# Altium project ludi_console_v1.PrjPcb
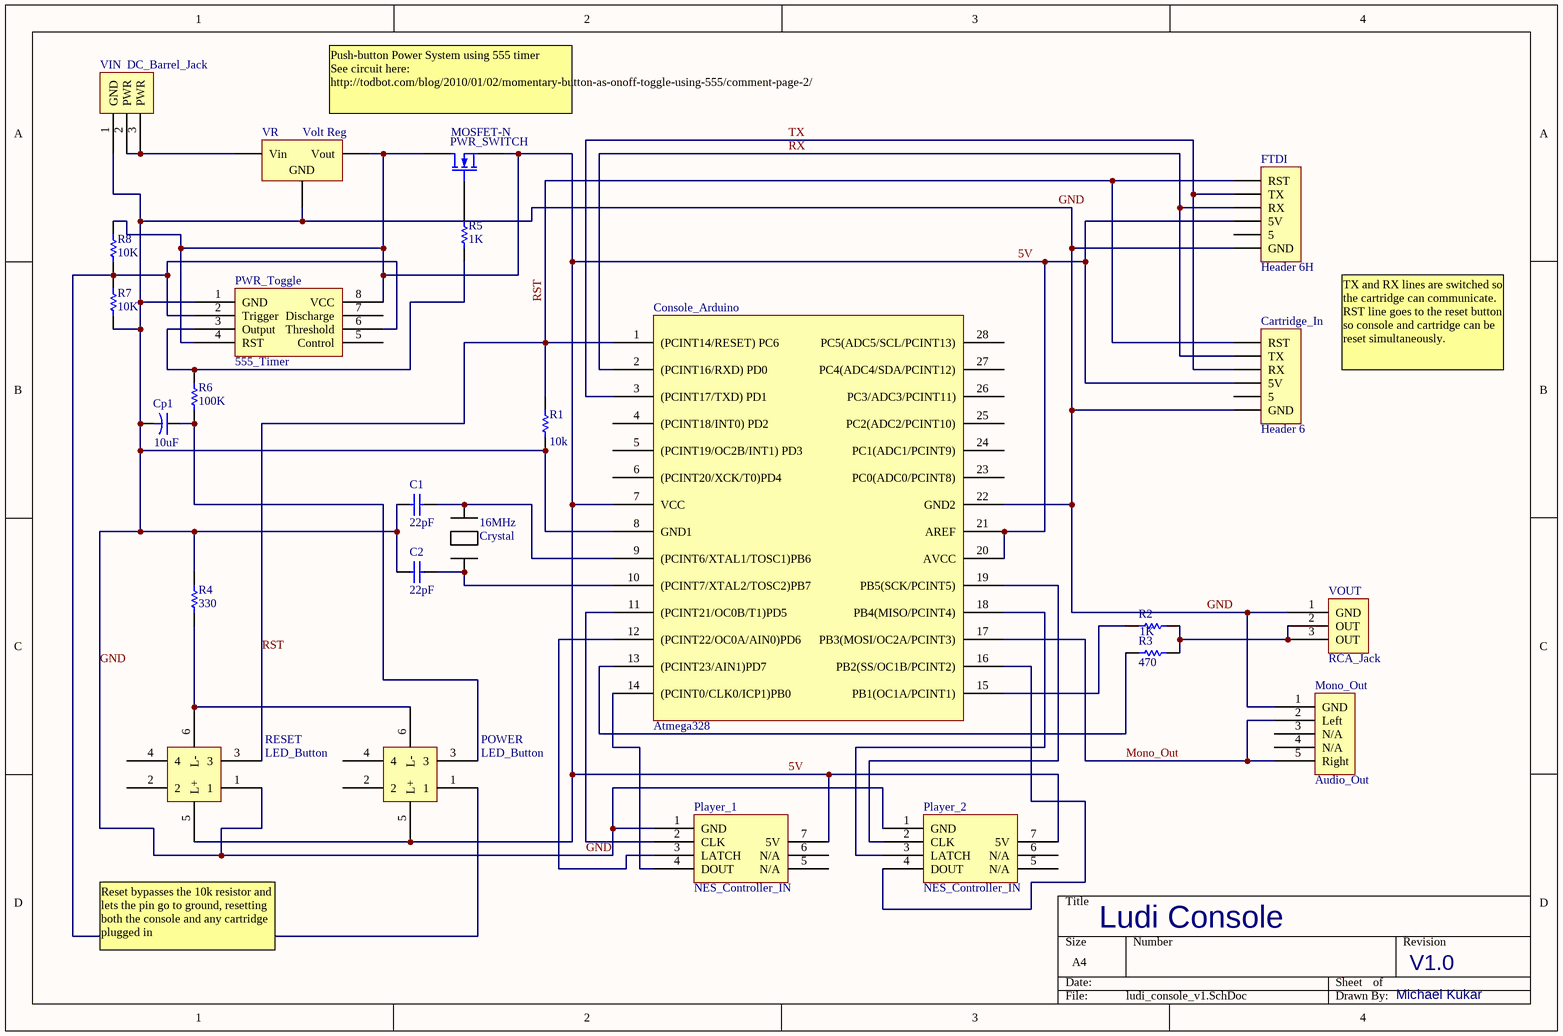
[diagram p0: ludi_console_v1.SchDoc]
1 sheet, 25 parts. Net scope: global (net labels, ports and power ports of the same name join across sheets).

## Sheet ludi_console_v1.SchDoc
size A4

### Parts
16MHz  Crystal  [Crystal - duplicate]
C1  value 22pF  [RAD-0.3]  (hidden comment: Cap)
C2  value 22pF  [RAD-0.3]  (hidden comment: Cap)
Cartridge_In  Header 6  [HDR1X6]
Console_Arduino  Atmega328  [DIP-28]
Cp1  value 10uF  [CAPR5-4X5]  (hidden comment: Cap2)
FTDI  Header 6H  [HDR1X6H]
Mono_Out  Audio_Out
Player_1  NES_Controller_IN
Player_2  NES_Controller_IN
POWER  LED_Button
PWR_SWITCH  MOSFET-N  [E3]
PWR_Toggle  555_Timer
R1  value 10k  [AXIAL-0.3]  (hidden comment: Res1)
R2  value 1K  [AXIAL-0.3]  (hidden comment: Res1)
R3  value 470  [AXIAL-0.3]  (hidden comment: Res1)
R4  value 330  [AXIAL-0.3]  (hidden comment: Res1)
R5  value 1K  [AXIAL-0.3]  (hidden comment: Res1)
R6  value 100K  [AXIAL-0.3]  (hidden comment: Res1)
R7  value 10K  [AXIAL-0.3]  (hidden comment: Res1)
R8  value 10K  [AXIAL-0.3]  (hidden comment: Res1)
RESET  LED_Button
VIN  DC_Barrel_Jack
VOUT  RCA_Jack  [RCA_Jack]
VR  Volt Reg  [D2PAK_L]

### Nets
5V: Cartridge_In.4(5V) Console_Arduino.7(VCC) Console_Arduino.20(AVCC) Console_Arduino.21(AREF) FTDI.4(5V) Player_1.7(5V) Player_2.7(5V) POWER.5(L+) PWR_SWITCH.1(D) PWR_SWITCH.3(S) PWR_Toggle.4(RST) PWR_Toggle.8(VCC) R8.2 RESET.5(L+) VR.3(Vout)
GND: C1.1 C2.1 Cartridge_In.6(GND) Console_Arduino.8(GND1) Console_Arduino.22(GND2) Cp1.2 FTDI.6(GND) Mono_Out.1(GND) Player_1.1(GND) Player_2.1(GND) PWR_Toggle.1(GND) R1.1 R4.2 R7.1 RESET.1 VIN.1(GND) VOUT.1(GND) VR.2(GND)
Mono_Out: Console_Arduino.17(PB3(MOSI/OC2A/PCINT3)) Mono_Out.2(Left) Mono_Out.5(Right)
RST: Cartridge_In.1(RST) Console_Arduino.1((PCINT14/RESET)_PC6) FTDI.1(RST) R1.2 RESET.3
RX: Cartridge_In.2(TX) Console_Arduino.2((PCINT16/RXD)_PD0) FTDI.3(RX)
TX: Cartridge_In.3(RX) Console_Arduino.3((PCINT17/TXD)_PD1) FTDI.2(TX)
Net16MHz_A: 16MHz.A C2.2 Console_Arduino.10((PCINT7/XTAL2/TOSC2)PB7)
Net16MHz_K: 16MHz.K C1.2 Console_Arduino.9((PCINT6/XTAL1/TOSC1)PB6)
NetConsole_Arduino_11: Console_Arduino.11((PCINT21/OC0B/T1)PD5) Player_1.2(CLK)
NetConsole_Arduino_12: Console_Arduino.12((PCINT22/OC0A/AIN0)PD6) Player_1.3(LATCH)
NetConsole_Arduino_13: Console_Arduino.13((PCINT23/AIN1)PD7) R3.1
NetConsole_Arduino_14: Console_Arduino.14((PCINT0/CLK0/ICP1)PB0) Player_1.4(DOUT)
NetConsole_Arduino_15: Console_Arduino.15(PB1(OC1A/PCINT1)) R2.1
NetConsole_Arduino_16: Console_Arduino.16(PB2(SS/OC1B/PCINT2)) Player_2.4(DOUT)
NetConsole_Arduino_18: Console_Arduino.18(PB4(MISO/PCINT4)) Player_2.3(LATCH)
NetConsole_Arduino_19: Console_Arduino.19(PB5(SCK/PCINT5)) Player_2.2(CLK)
NetCp1_1: Cp1.1 POWER.3 R6.1
NetPOWER_1: POWER.1 PWR_Toggle.2(Trigger) PWR_Toggle.6(Threshold) R7.2 R8.1
NetPOWER_6: POWER.6(L-) R4.1 RESET.6(L-)
NetPWR_SWITCH_2: PWR_SWITCH.2(G) R5.2
NetPWR_Toggle_3: PWR_Toggle.3(Output) R5.1 R6.2
NetR2_2: R2.2 R3.2 VOUT.2(OUT) VOUT.3(OUT)
NetVIN_2: VIN.2(PWR) VIN.3(PWR) VR.1(Vin)

Not connected (* = marked no-connect by the designer): Cartridge_In 5; Console_Arduino 4((PCINT18/INT0)_PD2) 5((PCINT19/OC2B/INT1)_PD3) 6((PCINT20/XCK/T0)PD4) 23(PC0(ADC0/PCINT8)) 24(PC1(ADC1/PCINT9)) 25(PC2(ADC2/PCINT10)) 26(PC3/ADC3/PCINT11)) 27(PC4(ADC4/SDA/PCINT12)) 28(PC5(ADC5/SCL/PCINT13)); FTDI 5; Mono_Out 3(N/A) 4(N/A); Player_1 5(N/A) 6(N/A); Player_2 5(N/A) 6(N/A); POWER 2 4; PWR_Toggle 5(Control) 7(Discharge); RESET 2 4

### Notes on the sheet
- Push-button Power System using 555 timer
  See circuit here: http://todbot.com/blog/2010/01/02/momentary-button-as-onoff-toggle-using-555/comment-page-2/
- TX and RX lines are switched so the cartridge can communicate. RST line goes to the reset button so console and cartridge can be reset simultaneously.
- Reset bypasses the 10k resistor and lets the pin go to ground, resetting both the console and any cartridge plugged in
- Ludi Console
- V1.0
- Michael Kukar

### Library data of the parts
C1 C2 = Cap: Capacitor; Published: 8-Jun-2000; LatestRevisionDate: 17-Jul-2002; LatestRevisionNote: Re-released for DXP Platform.; PackageReference: RAD-0.3; Publisher: Altium Limited; PackageDescription: Radial Cap, Thru-Hole; 2 Leads; 0.3 in Pin Spacing
Cartridge_In = Header 6: Header, 6-Pin; LatestRevisionDate: 17-Jul-2002; LatestRevisionNote: Re-released for DXP Platform.; Publisher: Altium Limited
Cp1 = Cap2: Capacitor; Published: 23-Sep-2002; PackageReference: CAPR5-4X5; Publisher: Altium Limited; PackageDescription: Capacitor; 2 Leads
FTDI = Header 6H: Header, 6-Pin, Right Angle; LatestRevisionDate: 17-Jul-2002; LatestRevisionNote: Re-released for DXP Platform.; Publisher: Altium Limited
PWR_SWITCH = MOSFET-N: N-Channel MOSFET; Published: 8-Jun-2000; LatestRevisionDate: 17-Jul-2002; LatestRevisionNote: Re-released for DXP Platform.; PackageVersion: 1995/1996; PackageReference: E3; Publisher: Altium Limited; PackageDescription: TO, Flat Index; 3 In-Line, Axial Leads; Body Dia. 4.6mm; Lead Dia. 0.5 mm (max)
R1-R8 = Res1: Resistor; Published: 8-Jun-2000; LatestRevisionDate: 17-Jul-2002; LatestRevisionNote: Re-released for DXP Platform.; PackageReference: AXIAL-0.3; Publisher: Altium Limited; PackageDescription: Axial Device, Thru-Hole; 2 Leads; 0.3 in Pin Spacing
VR = Volt Reg: Voltage Regulator; Published: 24-Mar-1999; LatestRevisionDate: 29-May-2009; LatestRevisionNote: IPC-7351 Footprint Added.; PackageReference: D2PAK; Publisher: Altium Limited; PackageDescription: 3-Pin Transistor Outline Package 2.54 mm Pitch, 15.1 mm Lead Span